# Altium schematic sheet schematic.schdoc
size 139 x 102 mm
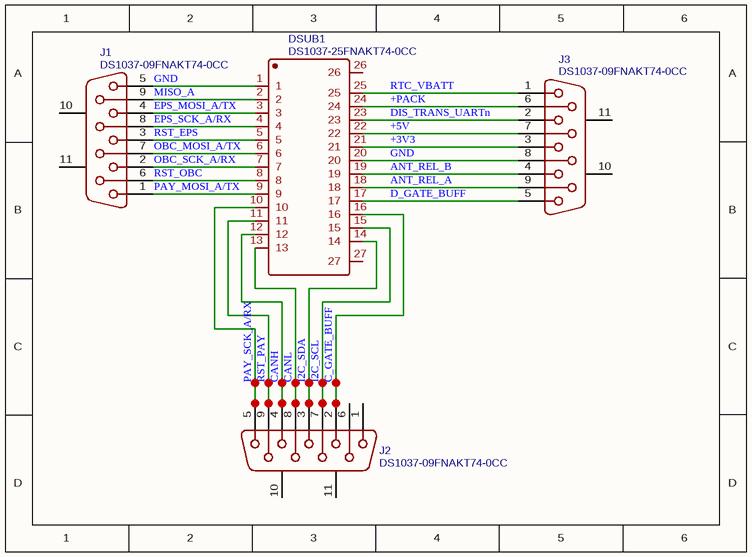
[diagram p0: schematic.schdoc]

## Parts
DSUB1  DS1037-25FNAKT74-0CC  [DS1037-25FNAKT74-0CC]
J1  DS1037-09FNAKT74-0CC  [DSUB9-1]
J2  DS1037-09FNAKT74-0CC  [DSUB9-1]
J3  DS1037-09FNAKT74-0CC  [DSUB9-1]

## Nets
+3V3: DSUB1.21 J3.3
+5V: DSUB1.22 J3.7
+PACK: DSUB1.24 J3.6
ANT_REL_A: DSUB1.18 J3.9
ANT_REL_B: DSUB1.19 J3.4
C_GATE_BUFF: DSUB1.16 J2.2
CANH: DSUB1.12 J2.4
CANL: DSUB1.13 J2.8
D_GATE_BUFF: DSUB1.17 J3.5
DIS_TRANS_UARTn: DSUB1.23 J3.2
EPS_MOSI_A/TX: DSUB1.3 J1.4
EPS_SCK_A/RX: DSUB1.4 J1.8
GND: DSUB1.1 DSUB1.20 J1.5 J3.8
I2C_SCL: DSUB1.15 J2.7
I2C_SDA: DSUB1.14 J2.3
MISO_A: DSUB1.2 J1.9
OBC_MOSI_A/TX: DSUB1.6 J1.7
OBC_SCK_A/RX: DSUB1.7 J1.2
PAY_MOSI_A/TX: DSUB1.9 J1.1
PAY_SCK_A/RX: DSUB1.10 J2.5
RST_EPS: DSUB1.5 J1.3
RST_OBC: DSUB1.8 J1.6
RST_PAY: DSUB1.11 J2.9
RTC_VBATT: DSUB1.25 J3.1

Not connected (* = marked no-connect by the designer): DSUB1 26 27; J1 10(MH1) 11(MH2); J2 1 6 10(MH1) 11(MH2); J3 10(MH1) 11(MH2)

## Library data of the parts
DSUB1 = DS1037-25FNAKT74-0CC: BOM_Manufacturer: CONNFLY; BOM_Supplier: LCSC; BOM_Manufacturer Part: DS1037-25FNAKT74-0CC; BOM_Supplier Part: C77838; spicePre: D
J1-J3 = DS1037-09FNAKT74-0CC: BOM_Manufacturer: CONNFLY; BOM_Supplier: LCSC; BOM_Manufacturer Part: DS1037-09FNAKT74-0CC; image: //image.lceda.cn/szlcsc/C75749.jpg; BOM_Supplier Part: C75749; spicePre: J